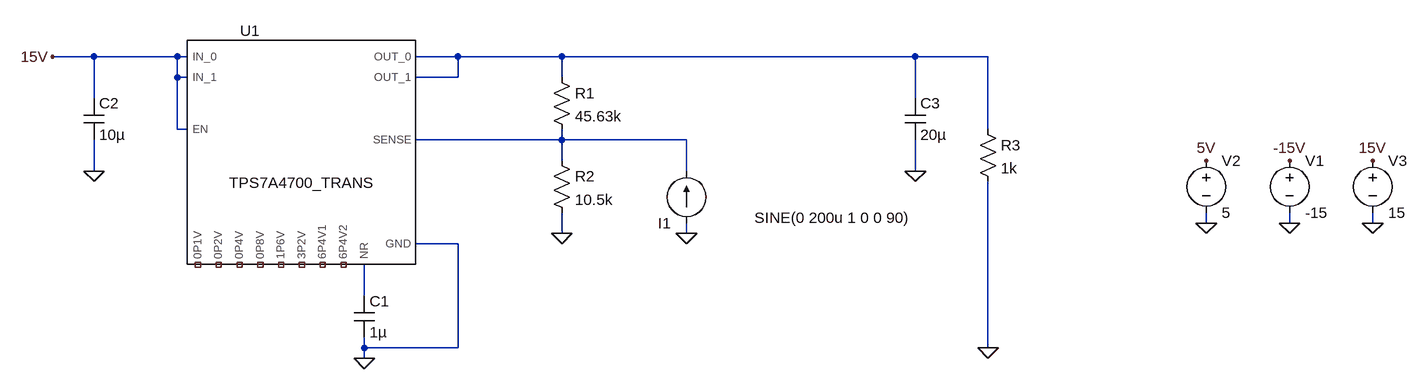
[diagram p0: schematic outputControl_TPS7A4700.asc]
outputControl_TPS7A4700.asc, the LTspice schematic file:
Version 4.1
SHEET 1 1592 680
WIRE -432 0 -496 0
WIRE -304 0 -432 0
WIRE -288 0 -304 0
WIRE 128 0 64 0
WIRE 288 0 128 0
WIRE 832 0 288 0
WIRE 944 0 832 0
WIRE -304 32 -304 0
WIRE -288 32 -304 32
WIRE 128 32 128 0
WIRE 128 32 64 32
WIRE 288 32 288 0
WIRE -432 64 -432 0
WIRE 832 64 832 0
WIRE -304 112 -304 32
WIRE -288 112 -304 112
WIRE 944 112 944 0
WIRE 288 128 288 112
WIRE 288 128 64 128
WIRE 480 128 288 128
WIRE 288 160 288 128
WIRE -432 176 -432 128
WIRE 480 176 480 128
WIRE 832 176 832 128
WIRE 1280 256 1280 240
WIRE 1408 256 1408 240
WIRE 1536 256 1536 240
WIRE 288 272 288 240
WIRE 480 272 480 256
WIRE 128 288 64 288
WIRE -16 368 -16 320
WIRE -16 448 -16 432
WIRE 128 448 128 288
WIRE 128 448 -16 448
WIRE 944 448 944 192
WIRE -16 464 -16 448
FLAG -16 464 0
FLAG -496 0 15V
FLAG -432 176 0
FLAG 832 176 0
FLAG 288 272 0
FLAG 944 448 0
FLAG 480 272 0
FLAG 1408 256 0
FLAG 1408 160 -15V
FLAG 1280 256 0
FLAG 1280 160 5V
FLAG 1536 256 0
FLAG 1536 160 15V
SYMBOL TPS7A4700_TRANS -192 112 R0
WINDOW 3 80 66 Top 2
SYMATTR InstName U1
SYMBOL cap -32 368 R0
SYMATTR InstName C1
SYMATTR Value 1µ
SYMBOL cap -448 64 R0
SYMATTR InstName C2
SYMATTR Value 10µ
SYMBOL cap 816 64 R0
SYMATTR InstName C3
SYMATTR Value 20µ
SYMBOL res 272 16 R0
SYMATTR InstName R1
SYMATTR Value 45.63k
SYMBOL res 272 144 R0
SYMATTR InstName R2
SYMATTR Value 10.5k
SYMBOL res 928 96 R0
SYMATTR InstName R3
SYMATTR Value 1k
SYMBOL current 480 256 R180
WINDOW 3 -345 8 Left 2
WINDOW 123 0 0 Left 0
WINDOW 39 0 0 Left 0
SYMATTR Value SINE(0 200u 1 0 0 90)
SYMATTR InstName I1
SYMBOL voltage 1408 144 R0
WINDOW 123 0 0 Left 0
WINDOW 39 0 0 Left 0
SYMATTR InstName V1
SYMATTR Value -15
SYMBOL voltage 1280 144 R0
WINDOW 123 0 0 Left 0
WINDOW 39 0 0 Left 0
SYMATTR InstName V2
SYMATTR Value 5
SYMBOL voltage 1536 144 R0
WINDOW 123 0 0 Left 0
WINDOW 39 0 0 Left 0
SYMATTR InstName V3
SYMATTR Value 15

The netlist it stands for:
* outputControl_TPS7A4700.asc
X§U1 NC_01 NC_02 NC_03 NC_04 NC_05 NC_06 NC_07 NC_08 15V 0 N003 N002 15V 15V N001 N001 TPS7A4700_TRANS  ; pins 0P1V 0P2V 0P4V 0P8V 1P6V 3P2V 6P4V1 6P4V2 EN GND NR SENSE IN_0 IN_1 OUT_0 OUT_1
C1 N003 0 1µ
C2 15V 0 10µ
C3 N001 0 20µ
R1 N001 N002 45.63k
R2 N002 0 10.5k
R3 N001 0 1k
I1 0 N002 SINE(0 200u 1 0 0 90)
V1 -15V 0 -15
V2 5V 0 5
V3 15V 0 15
.lib tps7a4700_trans.lib
.backanno
.end